# EAGLE design SparkFun_Blackberry_Trackballer_Breakout_v13 (EAGLE 6.4)
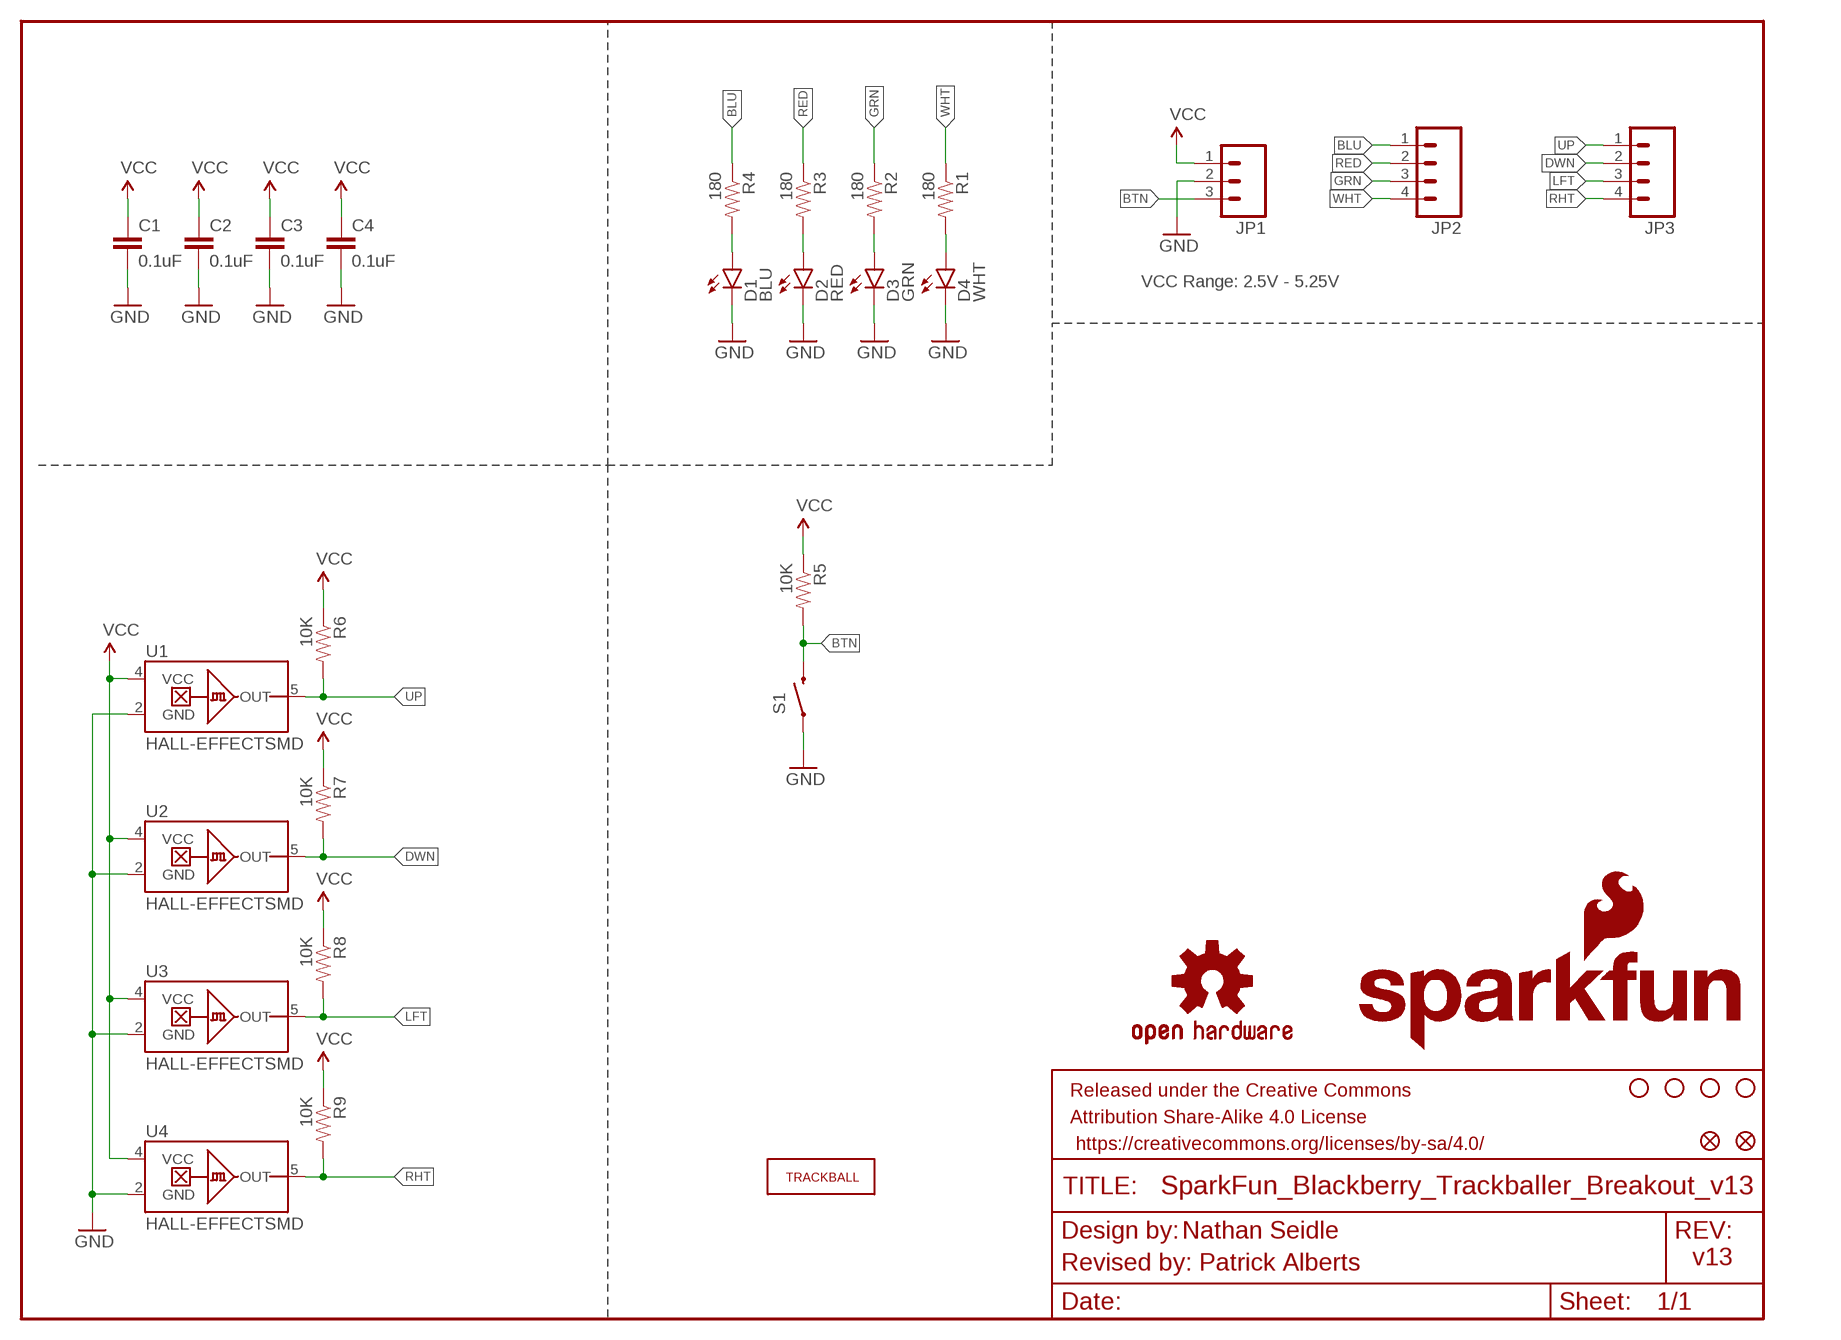
[diagram p0: schematic, sheet 1]

## Parts
C1  0.1uF  0.1UF-25V(+80/-20%)(0603)  [0603-CAP]
C2  0.1uF  0.1UF-25V(+80/-20%)(0603)  [0603-CAP]
C3  0.1uF  0.1UF-25V(+80/-20%)(0603)  [0603-CAP]
C4  0.1uF  0.1UF-25V(+80/-20%)(0603)  [0603-CAP]
D1  BLU  LED-BLUE0603  [LED-0603]
D2  RED  LED-RED0603  [LED-0603]
D3  GRN  LED-GREEN0603  [LED-0603]
D4  WHT  LED-WHITE0603  [LED-0603]
E$1  FIDUCIAL1X2  [FIDUCIAL-1X2]
E$2  FIDUCIAL1X2  [FIDUCIAL-1X2]
FRAME1  FRAME-LETTER  [CREATIVE_COMMONS]
JP1  M03PTH  [1X03]
JP2  M04PTH  [1X04]
JP3  M04PTH  [1X04]
LOGO1  SFE_LOGO_NAME_FLAME.2_INCH  [SFE_LOGO_NAME_FLAME_.2]
LOGO2  OSHW-LOGOS  [OSHW-LOGO-S]
R1  180  180OHM1/10W1%(0603)  [0603-RES]
R2  180  180OHM1/10W1%(0603)  [0603-RES]
R3  180  180OHM1/10W1%(0603)  [0603-RES]
R4  180  180OHM1/10W1%(0603)  [0603-RES]
R5  10K  10KOHM1/10W1%(0603)0603  [0603-RES]
R6  10K  10KOHM1/10W1%(0603)0603  [0603-RES]
R7  10K  10KOHM1/10W1%(0603)0603  [0603-RES]
R8  10K  10KOHM1/10W1%(0603)0603  [0603-RES]
R9  10K  10KOHM1/10W1%(0603)0603  [0603-RES]
S1  SWITCH-MOMENTARY-2SMD-2  [TACTILE_SWITCH_SMD-2]
U1  HALL-EFFECTSMD  [SC70]
U2  HALL-EFFECTSMD  [SC70]
U3  HALL-EFFECTSMD  [SC70]
U4  HALL-EFFECTSMD  [SC70]
U$1  STAND-OFF  [STAND-OFF]
U$3  TRACKBALLMECH  [TRACKBALL]
U$8  STAND-OFF  [STAND-OFF]
U$11  STAND-OFF  [STAND-OFF]
U$14  STAND-OFF  [STAND-OFF]

## Nets
BLU: JP2.1 R4.1
BTN: JP1.3 R5.2 S1.1
DWN: JP3.2 R7.2 U2.5(OUT)
GND: C1.2 C2.2 C3.2 C4.2 D1.C D2.C D3.C D4.C JP1.2 S1.2 U1.2(GND) U2.2(GND) U3.2(GND) U4.2(GND)
GRN: JP2.3 R2.1
LFT: JP3.3 R8.2 U3.5(OUT)
N$1: D3.A R2.2
N$2: D2.A R3.2
N$3: D1.A R4.2
N$4: D4.A R1.2
RED: JP2.2 R3.1
RHT: JP3.4 R9.2 U4.5(OUT)
UP: JP3.1 R6.2 U1.5(OUT)
VCC: C1.1 C2.1 C3.1 C4.1 JP1.1 R5.1 R6.1 R7.1 R8.1 R9.1 U1.4(VCC) U2.4(VCC) U3.4(VCC) U4.4(VCC)
WHT: JP2.4 R1.1

## Notes on the sheet
- VCC Range: 2.5V - 5.25V
- Nathan Seidle
- Revised by: Patrick Alberts | v13

## Library data of the parts
C1-C4 = SparkFun-Capacitors:0.1UF-25V(+80/-20%)(0603): CAP-00810 Ceramic Standard decoupling cap; PROD_ID: CAP-00810
D1 = SparkFun-LED:LED-BLUE: Blue LEDs for production use Various blue LEDs stocked by SparkFun production 0603 - DIO-08575 Rebel - DIO-09553 1206 - DIO-09911; PROD_ID: DIO-08575; VALUE: BLUE
D2 = SparkFun-LED:LED-RED: Assorted Red LEDs LilyPad 1206- DIO-09912 1206- DIO-00809 0603- DIO-00819; PROD_ID: DIO-00819
D3 = SparkFun-LED:LED-GREEN: Various green LEDs Green LEDs used in SFE Production 0603- DIO-00821 LARGE- DIO-00862 LILYPAD- DIO-09910; PROD_ID: DIO-00821; VALUE: GREEN
D4 = SparkFun-LED:LED-WHITE: White SMD LEDs LilyPad 1206- DIO-09955; PROD_ID: DIO-09004
E$1 E$2 = SparkFun:FIDUCIAL: Fiducial Alignment Points Various fiducial points for machine vision alignment.
FRAME1 = SparkFun-Aesthetics:FRAME-LETTER: Schematic Frame Standard 8.5x11 US Letter frame
JP1 = SparkFun:M03: Header 3 Standard 3-pin 0.1" header. Use with straight break away headers (SKU : PRT-00116), right angle break away headers (PRT-00553), swiss pins (PRT-00743), machine pins (PRT-00117), and female headers (PRT-00115). Molex polarized connector foot print use with SKU : PRT-08232 with associated crimp pins and housings.
JP2 JP3 = SparkFun:M04: Header 4 Standard 4-pin 0.1" header. Use with straight break away headers (SKU : PRT-00116), right angle break away headers (PRT-00553), swiss pins (PRT-00743), machine pins (PRT-00117), and female headers (PRT-00115). Molex polarized connector foot print use with SKU : PRT-08231 with associated crimp pins and housings.
LOGO1 = SparkFun-Aesthetics:SFE_LOGO_NAME_FLAME: SFE Logo, name and flame This is the SparkFun full logo. The logo on the schematic will always be the same size; the package variant is the height of the flame part of the logo. Default layer for the logo on the board is tSilk.
LOGO2 = SparkFun-Aesthetics:OSHW-LOGO: Open Source Hardware Logo This logo indicates the piece of hardware it is found on incorporates a OSHW license and/or adheres to the definition of open source hardware found here: http://freedomdefined.org/OSHW
R1-R4 = SparkFun-Resistors:180OHM1/10W1%(0603): RES-08788; PROD_ID: RES-08788
R5-R9 = SparkFun-Resistors:10KOHM1/10W1%(0603): RES-00824; PROD_ID: RES-00824
S1 = SparkFun-Electromechanical:SWITCH-MOMENTARY-2: Various NO switches- pushbuttons, reed, etc; PROD_ID: SWCH-09213
U1-U4 = SparkFun-Sensors:HALL-EFFECT: Hall effect sensor in SC70 package; PROD_ID: IC-09214
U$1 U$8 U$11 U$14 = SparkFun:STAND-OFF: Stand Off This is the mechanical footprint for a #4 phillips button head screw. Use the keepout ring to avoid running the screw head into surrounding components. SKU : PRT-00447
U$3 = SparkFun-Electromechanical:TRACKBALL: Mechanical footprint for trackball; PROD_ID: COMP-09237

## Net classes
0 default: width 0.203 mm
1 power: width 0.203 mm

## Board
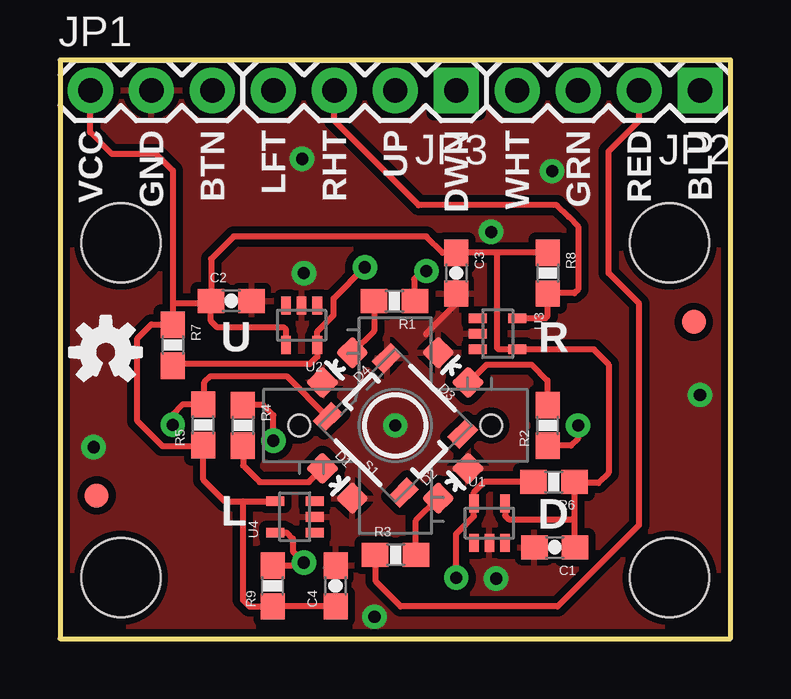
[diagram p1: board, top side]
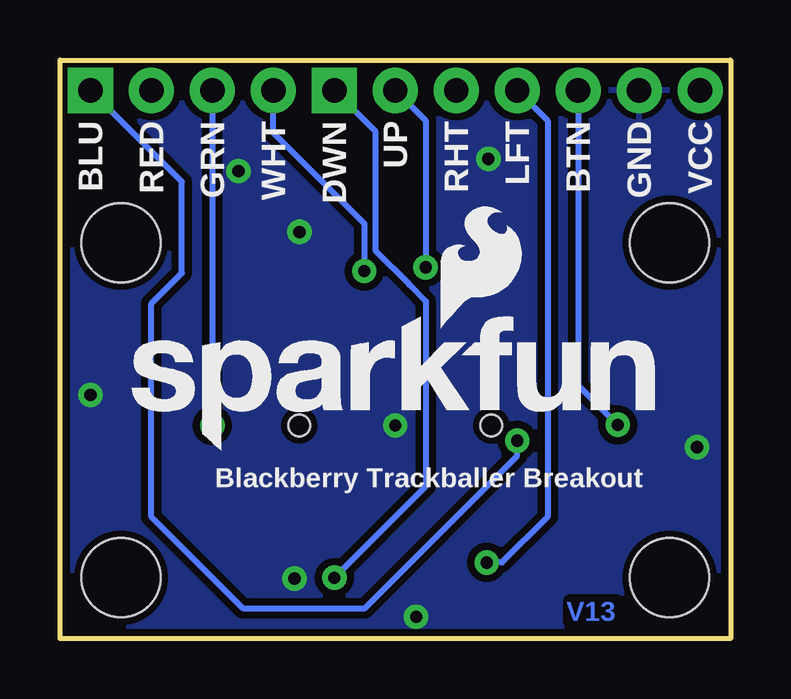
[diagram p2: board, bottom side, seen from below]

Size 27.94 x 24.13 mm. Coordinates in mm from the lower left corner, seen from the top.
Outline: 27.94,24.13 0,24.13 0,0 27.94,0 27.94,24.13
Copper layers (1*16): Top 0.035mm / dielectric 1.5mm / Bottom 0.035mm
Design rules "SparkFun-2-layer": minimum track width 7mil, minimum drill 15mil, track to track 8mil, track to pad 8mil, pad to pad 8mil, via to via 8mil, smd to smd 8mil, copper to edge 8mil, drill to drill 8mil, minimum pad ring 12mil, minimum via ring 10mil, stop-mask expansion 4mil, vias tented up to drill 20mil, thermal gap 10mil

### Footprints (pad centres in the part's own frame; a part is rotated, then mirrored left to right if it is on the bottom)
0603-CAP = smd 1.1 x 1: 1 -0.85,0; 2 0.85,0
LED-0603 = smd 1 x 1: A 0,-0.877; C 0,0.877
FIDUCIAL-1X2 = smd 1 x 1: 1 0,0
1X03 = drill 1.016 pad 1.88: 1 0,0; 2 2.54,0; 3 5.08,0
1X04 = drill 1.016 pad 1.88 square: 1 0,0 | drill 1.016 pad 1.88: 2 2.54,0; 3 5.08,0; 4 7.62,0
0603-RES = smd 1.1 x 1: 1 -0.85,0; 2 0.85,0
TACTILE_SWITCH_SMD-2 = smd 0.7 x 1.1: 1 2.225,1.75; 2 2.225,-1.75; 3 -2.225,-1.75; 4 -2.225,1.75
SC70 = smd 0.4 x 0.75: 1 -0.65,-0.825; 2 0,-0.825; 3 0.65,-0.825; 4 0.65,0.825; 5 -0.65,0.825
STAND-OFF = hole 3.302: 0,0
TRACKBALL = hole 0.9: -4,0; 4,0

### Placement (x,y rotation side)
C1  20.62,3.81 180 top
C2  7.14,14.09 0 top
C3  16.51,15.24 270 top
C4  11.48,2.2 90 top
D1  11.56,6.48 225 top
D2  16.38,6.48 315 top
D3  16.38,11.3 45 top
D4  11.56,11.3 135 top
E$1  26.42,13.21 180 top
E$2  1.52,5.97 180 top
FRAME1  -17.25,-12.7 0 top  (outside the outline)
JP1  1.27,22.86 0 top
JP2  26.67,22.86 180 top
JP3  16.51,22.86 180 top
LOGO1  25.65,7.75 0 bottom
LOGO2  1.91,11.94 0 top
R1  13.94,14.08 180 top
R2  20.32,8.89 90 top
R3  13.98,3.49 0 top
R4  7.62,8.89 270 top
R5  5.97,8.92 90 top
R6  20.58,6.54 180 top
R7  4.7,12.24 270 top
R8  20.32,15.24 270 top
R9  8.86,2.2 90 top
S1  13.97,8.89 135 top
U1  17.9,4.82 0 top
U2  10.07,13.07 180 top
U3  18.24,12.72 270 top
U4  9.79,5.08 90 top
U$1  2.54,16.51 0 top
U$3  13.97,8.89 0 top
U$8  25.4,16.51 0 top
U$11  2.54,2.54 0 top
U$14  25.4,2.54 0 top

### Tracks (layer width: path | path; a pad name or v marks a point on that pad's centre or on a via)
BLU  (via drill 0.51)
  Top 0.254: v8.89,8.26 8.89,9.32 8.46,9.75 7.63,9.75 R4.1
  Bottom 0.254: v8.89,8.26 8.89,7.62 15.24,1.27 20.32,1.27 24.13,5.08 24.13,13.97 22.86,15.24 22.86,19.05 JP2.1
BTN  (via drill 0.51)
  Top 0.254: 5.94,9.79 R5.2 | v4.7,8.91 4.7,9.36 5.12,9.78 5.96,9.78 R5.2 | R5.2 6.02,9.82 6.02,10.69 6.27,10.95 9.44,10.95 S1.1
  Bottom 0.254: JP1.3 6.35,10.57 v4.7,8.91
DWN  (via drill 0.51)
  Top 0.254: 11.04,13.13 10.72,12.81 U2.5 10.72,11.77 10.4,11.45 4.76,11.45 R7.2 | 11.04,13.13 | 11.04,13.13 11.4,13.49 11.4,14.19 v12.7,15.49
  Bottom 0.254: JP3.2 12.7,21.59 v12.7,15.49
GND  (via drill 0.51)
  Top 0.254: C3.2 16.51,13.97 15.24,12.7
  other vias: 18.17,2.51 13.97,8.89 10.16,15.24 17.96,16.96 1.4,7.98 13.1,0.91 26.67,10.16 10.09,20 20.5,19.5
  pour Top (isolate 0.305): 27.94,24.13 27.94,0 0,0 0,24.13
  pour Bottom (isolate 0.305): 27.94,24.13 27.94,0 0,0 0,24.13
GRN  (via drill 0.51)
  Top 0.254: v21.59,8.89 21.59,8.36 21.29,8.05 20.33,8.05 R2.1
  Bottom 0.254: JP2.3 v21.59,8.89
LFT
  Top 0.254: U3.5 20.23,13.37 20.32,13.46 R8.2 20.34,14.41 21.44,14.41 21.59,14.56 21.59,17.19 21.19,17.59 20.7,18.07 14.95,18.07 11.43,21.59 JP3.3
N$1
  Top 0.254: 20.3,9.72 R2.2 20.31,10.77 19.65,11.43 17.78,11.43 17.03,10.68 D3.A
N$2
  Top 0.254: 15.91,5.71 D2.A 14.83,4.93 R3.2
N$3
  Top 0.254: 7.62,7.62 R4.2 7.63,7.22 8.32,6.53 10.37,6.53 D1.A
N$4
  Top 0.254: 13.05,14.11 R1.2 13.09,12.83 D4.A
RED
  Top 0.254: R3.1 13.16,3.47 13.16,2.38 14.2,1.34 20.74,1.34 24.13,4.74 24.13,13.97 22.86,15.24 22.86,20.32 24.13,21.59 JP2.2
RHT  (via drill 0.51)
  Top 0.254: R9.2 10.03,3.05 v10.16,3.17 9.7,3.63 9.7,4.17 9.44,4.43 U4.5
  Bottom 0.254: JP3.4 7.62,21.59 7.62,5.08 9.53,3.17 v10.16,3.17
UP  (via drill 0.51)
  Top 0.254: 19.55,6.36 R6.2 19.72,6.55 17.7,6.55 17.25,6.09 U1.5 17.25,5.11 16.51,4.37 v16.51,2.54
  Bottom 0.254: v16.51,2.54 12.7,6.35 12.7,14.06 13.39,14.76 13.39,14.78 14.78,16.17 14.78,21.13 JP3.1
VCC
  Top 0.254: 7.62,5.73 6.87,5.73 5.97,6.63 R5.1 5.93,8.03 4.27,8.03 3.23,9.07 3.23,12.52 3.81,13.11 4.68,13.11 R7.1 4.7,13.97 | 7.62,5.73 U4.4 | 7.62,5.73 7.62,1.61 7.89,1.35 R9.1 | R8.1 18.21,16.09 | 18.21,16.09 C3.1 15.94,16.09 15.27,16.77 7.24,16.77 6.3,15.83 6.3,14.1 C2.1 | C2.1 | 18.21,16.09 18.21,12.13 18.28,12.07 U3.4 22.24,12.07 22.24,12.05 22.86,11.43 22.86,6.92 22.43,6.49 21.48,6.49 R6.1 21.43,5.08 | C2.1 6.35,14.03 6.29,13.97 4.7,13.97 | 21.43,5.08 21.43,3.85 C1.1 | C4.1 R9.1 | R9.1 | JP1.1 1.25,22.84 1.25,21.11 2.16,20.21 4.01,20.21 4.7,19.52 4.7,13.97 | U1.4 18.55,5.13 18.69,4.98 21.33,4.98 arc90 21.43,5.08 | U2.4 9.42,12.88 9.32,12.98 6.55,12.98 6.29,13.25 C2.1 | 6.27,14.08 C2.1
WHT  (via drill 0.51)
  Top 0.254: v15.26,15.33 15.08,15.33 14.75,14.99 14.75,14.11 R1.1
  Bottom 0.254: v15.26,15.33 15.26,17.31 19.05,21.09 JP2.4

### Text on the board
Bottom: V13
tPlace: VCC | GND | BTN | LFT | RHT | UP | DWN | WHT | GRN | RED | BLU | U | R | L | D
bPlace: VCC | GND | BTN | LFT | RHT | UP | DWN | WHT | GRN | RED | BLU | Blackberry Trackballer Breakout
tDocu: Nathan Seidle | Revised by: Patrick Alberts